# Altium schematic sheet ST_LINK_V2-1_2.SCHDOC: ST-LINK/V2-1
size A4; Date: 04/02/2015; Author: P.A.; CompanyName: STMicroelectronics; Organization: Microcontrollers Division; Address1: 12, Rue Jules HOROWITZ; Address2: 38019 Grenoble; Address3: FRANCE; DocumentNumber: MB1209; Revision: D-02; SheetNumber: 11; SheetTotal: 11; Project: STM32F412G-DISCO; ModifiedDate: 6/2/2016
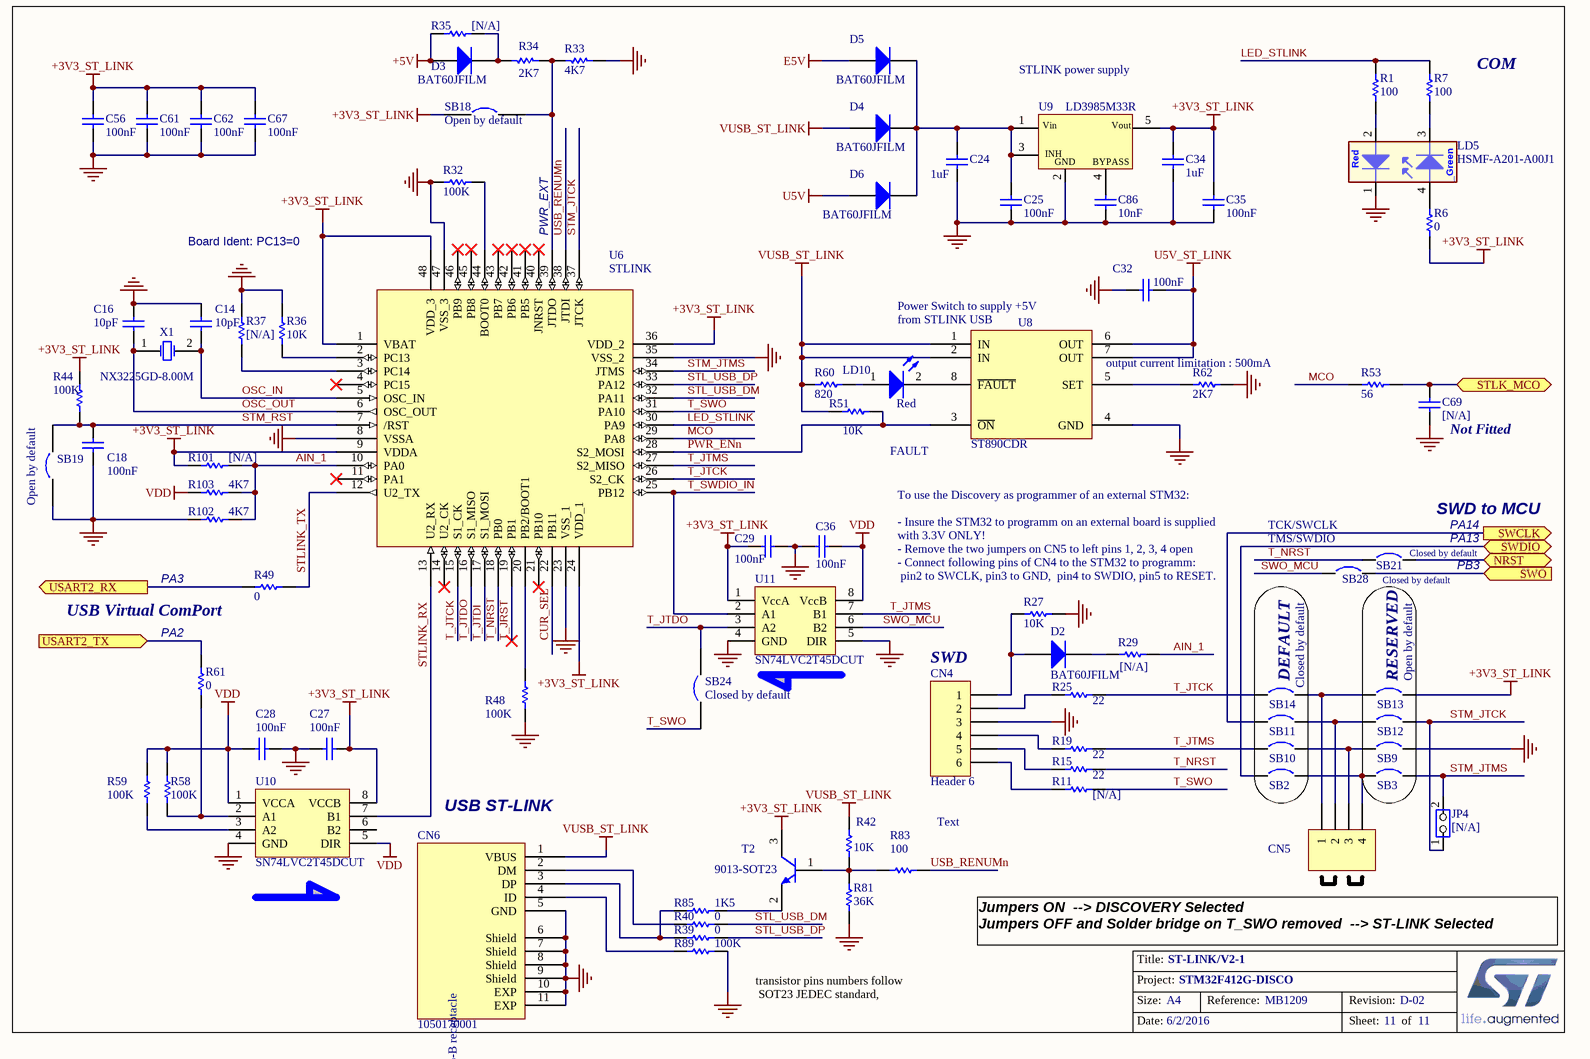
[diagram p0: ST_LINK_V2-1_2.SCHDOC]

## Parts
C14  10pF  [0603C]
C16  10pF  [0603C]
C18  100nF  [0402C]
C24  1uF  [0603C]
C25  100nF  [0402C]
C27  100nF  [0402C]
C28  100nF  [0402C]
C29  100nF  [0402C]
C32  100nF  [0402C]
C34  1uF  [0603C]
C35  100nF  [0402C]
C36  100nF  [0402C]
C56  100nF  [0402C]
C61  100nF  [0402C]
C62  100nF  [0402C]
C67  100nF  [0402C]
C69  [N/A]  [0603C]
C86  10nF  [0603C]
CN4  Header 6  [HDR_1X6_2R54_W]
CN5  Header 4  [HDR_1X4_2R54_W]  (value not drawn)
CN6  1050170001  [Molex_1050170001]
D2  BAT60JFILM  [SOD-323]
D3  BAT60JFILM  [SOD-323]
D4  BAT60JFILM  [SOD-323]
D5  BAT60JFILM  [SOD-323]
D6  BAT60JFILM  [SOD-323]
JP4  [N/A]  [SIP2]
LD5  HSMF-A201-A00J1  [LED2_3528]
LD10  Red  Silkscreen: FAULT  [0603D]
R1  100  [0402R]
R6  0  [SB_0603]
R7  100  [0402R]
R11  [N/A]  [0402R]
R15  22  [0402R]
R19  22  [0402R]
R25  22  [0402R]
R27  10K  [0402R]
R29  [N/A]  [0402R]
R32  100K  [0402R]
R33  4K7  [0603R]
R34  2K7  [0603R]
R35  [N/A]  [0402R]
R36  10K  [0402R]
R37  [N/A]  [0603R]
R39  0  [SB_0603]
R40  0  [SB_0603]
R42  10K  [0402R]
R44  100K  [0402R]
R48  100K  [0402R]
R49  0  [SB_0603]
R51  10K  [0402R]
R53  56  [0603R]
R58  100K  [0402R]
R59  100K  [0402R]
R60  820  [0402R]
R61  0  [SB_0603]
R62  2K7  [0603R]
R81  36K  [0603R]
R83  100  [0402R]
R85  1K5  [0603R]
R89  100K  [0402R]
R101  [N/A]  [0603R]
R102  4K7  [0603R]
R103  4K7  [0603R]
SB2  Closed by default  [SB_0603]
SB3  Open by default  [SB_0603]
SB9  Open by default  [SB_0603]  (value not drawn)
SB10  Closed by default  [SB_0603]  (value not drawn)
SB11  Closed by default  [SB_0603]  (value not drawn)
SB12  Open by default  [SB_0603]  (value not drawn)
SB13  Open by default  [SB_0603]  (value not drawn)
SB14  Closed by default  [SB_0603]  (value not drawn)
SB18  Open by default  [SB_0603]
SB19  Open by default  [SB_0603]
SB21  Closed by default  [SB_0603]
SB24  Closed by default  [SB_0603]
SB28  Closed by default  [SB_0603]
T2  9013-SOT23  [SOT-23]
U6  STLINK  [LQFP48_0R5_9X9]
U8  ST890CDR  [SOIC8_1R27_4R9X6]
U9  LD3985M33R  [SOT23-5]
U10  SN74LVC2T45DCUT  [USOP8_0R5_2X3R1]
U11  SN74LVC2T45DCUT  [USOP8_0R5_2X3R1]
X1  NX3225GD-8.00M  [XTAL_2SM_3R2X2R5]

## Blocks framed on the sheet
DEFAULT: SB2 SB10 SB11 SB14
RESERVED: SB3 SB9 SB12 SB13

## Ports
NRST, STLK_MCO, SWCLK (out), SWDIO (bidir), SWO (in), USART2_RX (out), USART2_TX (in)

## Nets
+3V3_ST_LINK: C27.1 C29.1 C34.1 C35.2 C56.2 C61.2 C62.2 C67.2 R6.2 R44.2 R101.1 SB13.2 SB18.1 T2.3(C) U6.1(VBAT) U6.9(VDDA) U6.24(VDD_1) U6.36(VDD_2) U6.48(VDD_3) U9.5(Vout) U10.8(VCCB) U11.1(VccA)
+5V: D3.1(A) R35.1
E5V: D5.1(A)
GND: C14.2 C16.2 C18.1 C24.1 C25.1 C27.2 C28.2 C29.2 C32.1 C34.2 C35.1 C36.1 C56.1 C61.1 C62.1 C67.1 C69.2 C86.1 CN4.3 CN6.5(GND) CN6.6(Shield) CN6.7(Shield) CN6.8(Shield) CN6.9(Shield) CN6.10(EXP) CN6.11(EXP) LD5.1 R27.1 R32.1 R33.2 R36.1 R37.1 R48.1 R62.2 R81.1 R89.2 R102.1 SB9.2 SB19.1 U6.8(VSSA) U6.23(VSS_1) U6.35(VSS_2) U6.47(VSS_3) U8.4(GND) U9.2(GND) U10.4(GND) U11.4(GND) U11.5(DIR)
U5V: D6.1(A)
U5V_ST_LINK: C32.2 U8.6(OUT) U8.7(OUT)
VDD: C28.1 C36.2 R58.1 R59.1 R103.1 U10.1(VCCA) U10.5(DIR) U11.8(VccB)
VUSB_ST_LINK: CN6.1(VBUS) D4.1(A) R42.2 R51.1 R60.2 U8.1(IN) U8.2(IN)
AIN_1: R29.2 R101.2 R102.2 R103.2 U6.10(PA0)
CUR_SEL: U6.22(PB11)
LED_STLINK: R1.1 R7.1 U6.30(PA9)
MCO: R53.2 U6.29(PA8)
NRST: SB21.2 ; port NRST
OSC_IN: C14.1 U6.5(OSC_IN) X1.2(OSC2)
OSC_OUT: C16.1 U6.6(OSC_OUT) X1.1(OSC1)
PWR_ENn: R51.2 U6.28(S2_MOSI) U8.3(~{ON})
STL_USB_DM: R40.2 U6.32(PA11)
STL_USB_DP: R39.2 U6.33(PA12)
STLINK_RX: U6.13(U2_RX) U10.7(B1)
STLINK_TX: R49.2 U6.12(U2_TX)
STLK_MCO: C69.1 R53.1 ; port STLK_MCO
STM_JTCK: JP4.1(COMMON) SB12.2 U6.37(JTCK)
STM_JTMS: JP4.2(NO) SB3.2 U6.34(JTMS)
STM_RST: C18.2 R44.1 SB19.2 U6.7(/RST)
SWCLK: SB11.1 ; port SWCLK
SWDIO: SB2.1 ; port SWDIO
SWO: SB28.2 ; port SWO
SWO_MCU: SB28.1 U11.6(B2)
T_JRST: U6.19(PB1)
T_JTCK: R25.2 SB14.1 U6.15(S1_CK) U6.26(S2_CK)
T_JTDI: U6.17(S1_MOSI)
T_JTDO: SB24.2 U6.16(S1_MISO) U11.3(A2)
T_JTMS: R19.2 SB10.1 U6.27(S2_MISO) U11.7(B1)
T_NRST: R15.2 SB21.1 U6.18(PB0)
T_SWDIO_IN: U6.25(PB12) U11.2(A1)
T_SWO: R11.2 SB24.1 U6.31(PA10)
USART2_RX: R49.1 ; port USART2_RX
USART2_TX: R61.1 ; port USART2_TX
USB_RENUMn: R83.2 U6.38(JTDI)
NetC24_2: C24.2 C25.2 D4.2(K) D5.2(K) D6.2(K) U9.1(Vin) U9.3(CE)
NetC86_2: C86.2 U9.4(BYPASS)
NetCN4_1: CN4.1 D2.1(A) R27.2
NetCN4_2: CN4.2 R25.1
NetCN4_4: CN4.4 R19.1
NetCN4_5: CN4.5 R15.1
NetCN4_6: CN4.6 R11.1
NetCN5_1: CN5.1 SB13.1 SB14.2
NetCN5_2: CN5.2 SB11.2 SB12.1
NetCN5_3: CN5.3 SB9.1 SB10.2
NetCN5_4: CN5.4 SB2.2 SB3.1
NetCN6_2: CN6.2(DM) R40.1
NetCN6_3: CN6.3(DP) R39.1 R85.1
NetCN6_4: CN6.4(ID) R89.1
NetD2_2: D2.2(K) R29.1
NetD3_2: D3.2(K) R34.1 R35.2
NetLD5_2: LD5.2 R1.2
NetLD5_3: LD5.3 R7.2
NetLD5_4: LD5.4 R6.1
NetLD10_1: LD10.1(A) R60.1
NetLD10_2: LD10.2(K) U8.8(~{FAULT})
NetR32_2: R32.2 U6.44(BOOT0)
NetR33_1: R33.1 R34.2 SB18.2 U6.39(JTDO)
NetR36_2: R36.2 U6.2(PC13)
NetR37_2: R37.2 U6.3(PC14)
NetR42_1: R42.1 R81.2 R83.1 T2.1(B)
NetR48_2: R48.2 U6.20(PB2/BOOT1)
NetR58_2: R58.2 R61.2 U10.2(A1)
NetR59_2: R59.2 U10.3(A2)
NetR62_1: R62.1 U8.5(SET)
NetR85_2: R85.2 T2.2(E)

Not connected (* = marked no-connect by the designer): U6 4(PC15)* 11(PA1)* 14(U2_CK)* 21(PB10)* 40(JNRST)* 41(PB5)* 42(PB6)* 43(PB7)* 45(PB8)* 46(PB9)*; U10 6(B2)

## Notes on the sheet
- (near U9) STLINK power supply
- (near R7) COM
- Board Ident: PC13=0
- PWR_EXT
- (near U8) Power Switch to supply +5V from STLINK USB
- output current limitation : 500mA
- (near C69) Not Fitted
- (near SB21) SWD to MCU
- PA3
- (near R27) To use the Discovery as programmer of an external STM32:
  - Insure the STM32 to programm on an external board is supplied with 3.3V ONLY!
  - Remove the two jumpers on CN5 to left pins 1, 2, 3, 4 open
  - Connect following pins of CN4 to the STM32 to programm:
  pin2 to SWCLK, pin3 to GND,  pin4 to SWDIO, pin5 to RESET.
- TCK/SWCLK
- (near SB28) TMS/SWDIO
- PA14
- (near SB21) PA13
- PB3
- USB Virtual ComPort
- (near R61) PA2
- (near CN4) SWD
- (near CN6) USB ST-LINK
- Text
- Jumpers ON  --> DISCOVERY Selected
  Jumpers OFF and Solder bridge on T_SWO removed  --> ST-LINK Selected
- transistor pins numbers follow
  SOT23 JEDEC standard,
- Title:
- Project:
- Size:
- Date:
- A4
- Reference:
- Sheet:
- Revision:
- of
- (in symbol 1050170001) USB_Micro-B receptacle
- (in symbol LD3985M33R) INH
- (in symbol LD_BICOLOR_CMS) Red; _Green

## Library data of the parts
C14 C16 = Capacitor_ST: Capacitor 0402 / 0603 / 0805; Value: 100nF; Ordered by: Subcon; ECCN_US/EU: NA; Revision: July-2002: Re-released for DXP Platform.
C18 C25 C32 C35 C56 C61 C62 C67 = Capacitor_ST: Capacitor 0402 / 0603 / 0805; Ordered by: Subcon; ECCN_US/EU: NA; Revision: July-2002: Re-released for DXP Platform.; Value: 100nF
C24 C34 = CAP SMD 0603  X5R 1µF 25V 10%: Capacitor; Value: 1µF; Rated voltage: 25V; Tolerance: 10%; Ordered by: Subcon; ECCN_US/EU: NA; Manufacturer: *; Manufacturer P/N: *; Order code Farnell: 1288202RL; Power: *; Technology: X5R; Temperature  Factor: *; Temperature Max: +125°C; Temperature Min: -55°C; STS Code: *
C27-C29 C36 = CAP: Capacitor; Value: 100pF; Ordered by: Subcon; ECCN_US/EU: NA; Published: 8-Jun-2000; Revision: July-2002: Re-released for DXP Platform.; Publisher: Altium Limited
C69 = Cap_20pF_NPO_5%_0402: Capacitor,20pF,50V,NPO,5%,0402,YAGEO; Order: CC0402JRNPO9BN200; Fitted: NO; Ordered by: Subcon; ECCN_US/EU: NA; Revision: July-2002: Re-released for DXP Platform.; Value: 20pF; Manuf_1: YAGEO; Manuf_Part_1: CC0402JRNPO9BN200
C86 = CAP SMD 0603  X7R 10000PF 50V 10%: 0603  X7R 10NF; Order code RS: 2040779; Rated voltage: 50V; Tolerance: 10%; Ordered by: Subcon; ECCN_US/EU: NA; Order code Farnell: 7569548RL; Value: 10NF; Power: *; Technology: X7R; Temperature Factor: *; Temperature Min: -55°C; Temperature Max: +125°C; STS Code: *
CN4 = Header 6: Header, 6-Pin; Ordered by: Subcon; Silkscreen: SWD; ECCN_US/EU: NA; LatestRevisionDate: 17-Jul-2002; LatestRevisionNote: Re-released for DXP Platform.; Publisher: Altium Limited
CN5 = Header 4: Header, 4-Pin; Assembly: with 2 jumpers; Ordered by: Subcon; Silkscreen: ST-LINK/DISCOVERY; ECCN_US/EU: NA; Revision: 17-Jul-2002: Re-released for DXP Platform.; Publisher: Altium Limited
CN6 = 1050170001: Silkscreen: USB; Ordered by: Subcon; ECCN_US/EU: NA
D2-D6 = BAT60JFILM: Provided: ST; ECCN_US/EU: EAR99/NEC; Ref St: 9151097; Revision: July-2002: Re-released for DXP Platform.; Order: BAT60JFILM; Manuf_Part_1: BAT60JFILM; Manuf_1: ST; Distrib: ST; Ordered by: ST
JP4 = JP2: Ordered by: Subcon; Fitted: NO; ECCN_US/EU: NA
LD5 = LD_BICOLOR_CMS: Bicolor Led; Manuf_1: Avago Technologies; Manuf_2: everluck; Manuf_Part_2: LE-RGW35280; ECCN_US/EU: EAR99/NEC; Silkscreen: COM; Ordered by: Subcon; Distrib: RADIOSPARES; Manuf_Part_1: HSMF-A201-A00J1; Footprint: HSMF-A201
LD10 = LED2: Typical RED, GREEN, YELLOW, AMBER GaAs LED; Ordered by: Subcon; ECCN_US/EU: EAR99/NEC; Published: 8-Jun-2000; Revision: July-2002: Re-released for DXP Platform.; Publisher: Altium Limited
R1 R6 R7 R33 R34 R42 R49 R53 R58 R59 R61 R81 = Res1: Resistor; Value: 1K; Ordered by: Subcon; ECCN_US/EU: NA; Published: 8-Jun-2000; Revision: July-2002: Re-released for DXP Platform.; Publisher: Altium Limited
R11 = res1: Resistor; Value: 22; Ordered by: Subcon; ECCN_US/EU: NA; Fitted: NO; Published: 8-Jun-2000; Revision: July-2002: Re-released for DXP Platform.; Publisher: Altium Limited
R15 R19 R25 R27 = res1: Resistor; Ordered by: Subcon; ECCN_US/EU: NA; Published: 8-Jun-2000; Revision: July-2002: Re-released for DXP Platform.; Publisher: Altium Limited
  R15 R19 R25: Value: 22
  R27: Value: 10K
R29 = Res_NA_0402: Resistor,[NA],0402; Fitted: NO; Ordered by: Subcon; ECCN_US/EU: NA; Value: [NA]
R32 R44 R48 R62 R83 R102 R103 = Resistor_ST: Resistor 0402 / 0603 / 0805; Value: 10K; Ordered by: Subcon; ECCN_US/EU: NA
R35 = Resistor_ST: Resistor; Value: 10K; Ordered by: Subcon; Fitted: NO; ECCN_US/EU: NA
R36 R51 = Resistor_ST: Resistor; Ordered by: Subcon; ECCN_US/EU: NA; Value: 10K
R37 R101 = Resistor_ST: Resistor 0402 / 0603 / 0805; Value: 10K; Fitted: NO; Ordered by: Subcon; ECCN_US/EU: NA
R39 R40 R85 = Resistor_ST: Resistor; Value: 10K; Ordered by: Subcon; ECCN_US/EU: NA
R60 R89 = res1: Resistor; Value: 1K; Ordered by: Subcon; ECCN_US/EU: NA; Published: 8-Jun-2000; Revision: July-2002: Re-released for DXP Platform.; Publisher: Altium Limited
SB2 SB10 SB11 SB14 SB21 SB28 = Circuit Breaker: Solder: YES; Ordered by: Subcon; ECCN_US/EU: NA; Revision: July-2002: Re-released for DXP Platform.
SB3 SB9 SB12 SB13 = Circuit Breaker: Solder: NO; Fitted: NO; Ordered by: Subcon; ECCN_US/EU: NA; Revision: July-2002: Re-released for DXP Platform.
SB18 SB19 = Circuit Breaker: Ordered by: Subcon; Comments: Solder bridge; Fitted: NO; ECCN_US/EU: NA; Published: 24-Mar-1999; Revision: July-2002: Re-released for DXP Platform.; Publisher: Altium Limited
SB24 = Circuit Breaker: Ordered by: Subcon; Comments: Solder bridge; ECCN_US/EU: NA; Published: 24-Mar-1999; Revision: July-2002: Re-released for DXP Platform.; Publisher: Altium Limited
T2 = NPN: NPN Bipolar Transistor; Manuf_Part_1: MMBT9013; Code - JEDEC: TO-226-AA; Ordered by: Subcon; ECCN_US/EU: EAR99/NEC; Published: 8-Jun-2000; Revision: July-2002: Re-released for DXP Platform.; Publisher: Altium Limited
U6 = STM32F10x(48pin): Manuf_Part_1: STM32F103CBT6; Ordered by: ST; ECCN_US/EU: 3A991A2/NEC; Ref St: 9175111; Distrib: ST; Manuf_1: ST
U8 = ST890CDR: Ordered by: ST; Ref St: 9172002; ECCN_US/EU: EAR99/NEC; Manuf_1: ST; Manuf_Part_1: ST890CDR
U9 = LD3985M33R: Ultra low drop-low noise BiCMOS voltage, regulators low ESR capacitors compatible; Manuf_1: ST; Manuf_Part_2: LDK120DM33R; Ref St: 9176161; ECCN_US/EU: EAR99/NEC; Manuf_Part_1: LD3985M33R; Provided: ST; Distrib: ST; Order: LD3985M33R; Ordered by: ST; Manuf_2: ST
U10 U11 = SN74LVC2T45DCUT: Manuf_1: TI; Ordered by: Subcon; ECCN_US/EU: EAR99/NEC; Manuf_Part_1: SN74LVC2T45DCUT
X1 = XTAL_8M_NX3225GD: Crystal 8Mhz, 8pF, -+50PPM, SMD; Manuf_1: NDK; Manuf_Part_1: NX3225GD 8MHz EXS00A-CG04874; Manuf_Part_2: NX3225GD-8.000M-STD-CRA-3; ECCN_US/EU: EAR99/NEC; NDK Ref: X3127326; Ref St: 9157029; Provided: ST; Order: NX3225GD 8MHz EXS00A-CG04874; Ordered by: ST